# EAGLE design 5v power supply (EAGLE 9.6.2)
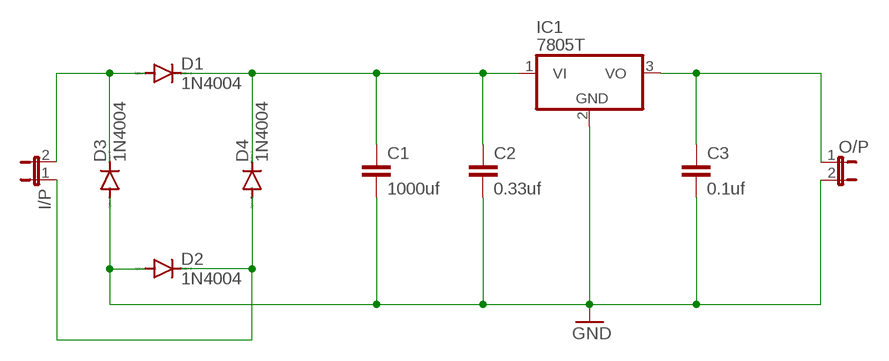
[diagram p0: schematic, sheet 1]

## Parts
C1  1000uf  C2,5-3  [C2.5-3]
C2  0.33uf  C2,5-3  [C2.5-3]
C3  0.1uf  C2,5-3  [C2.5-3]
D1  1N4004  [DO41-10]
D2  1N4004  [DO41-10]
D3  1N4004  [DO41-10]
D4  1N4004  [DO41-10]
I/P  JP1E  [JP1]
IC1  7805T  [TO220H]
O/P  JP1E  [JP1]

## Nets
GND: C1.2 C2.2 C3.2 D2.A D3.A IC1.2(GND) O/P.2
N$1: D1.A D3.C I/P.2
N$2: C1.1 C2.1 D1.C D4.C IC1.1(VI)
N$3: D2.C D4.A I/P.1
N$5: C3.1 IC1.3(VO) O/P.1

## Library data of the parts
C1-C3 = capacitor-wima:C: CAPACITOR naming: grid - package width
D1-D4 = diode:1N4004: DIODE general purpose rectifier, 1 A
I/P O/P = jumper:JP1E: JUMPER
IC1 = linear:78*: Positive VOLTAGE REGULATOR Source: http://cache.national.com/ds/LM/LM78L05.pdf http://www.fairchildsemi.com/ds/LM/LM7805.pdf

## Board
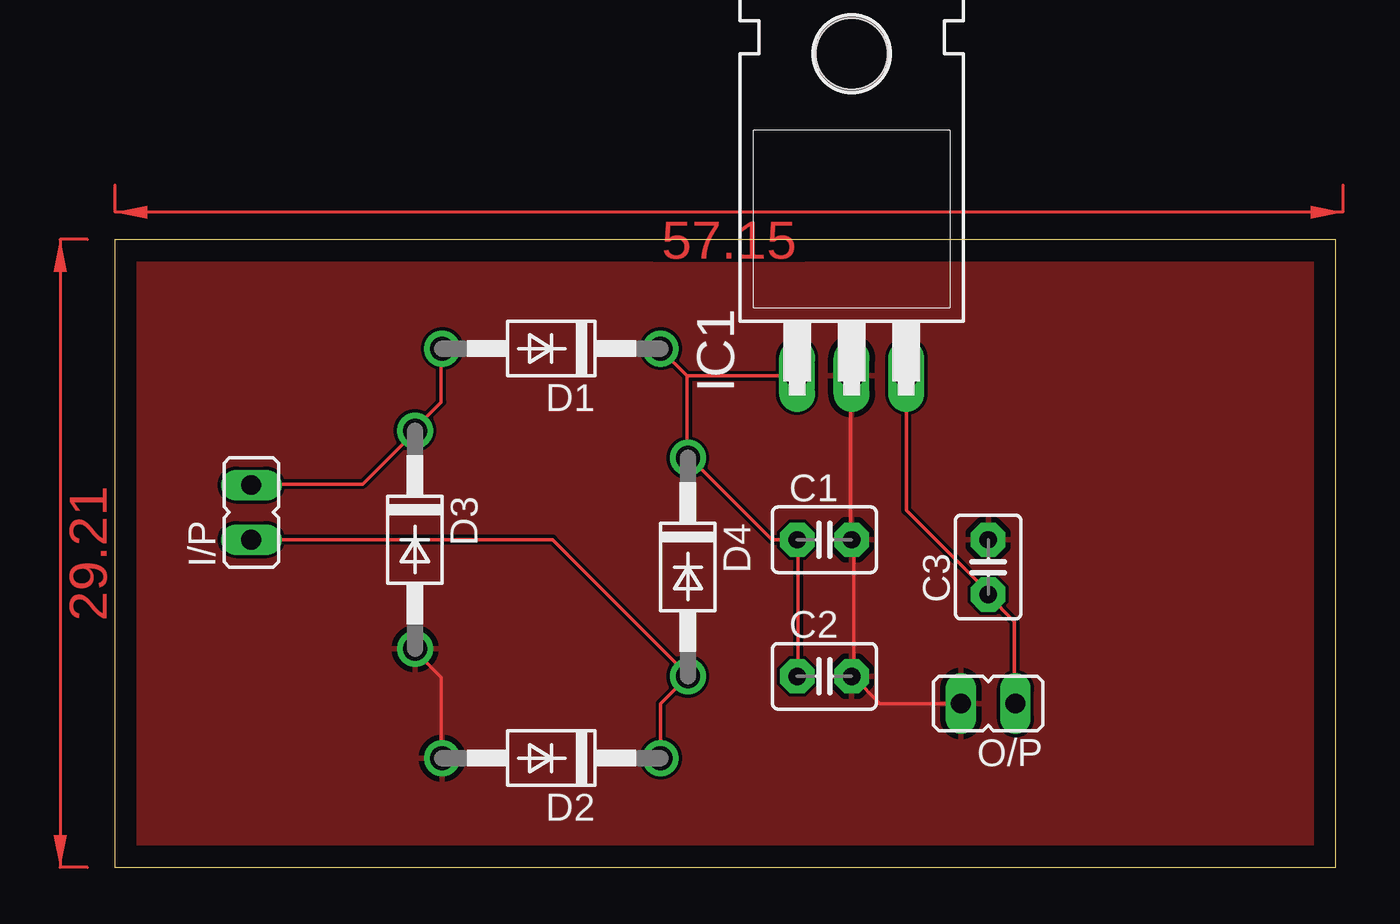
[diagram p1: board, top side]
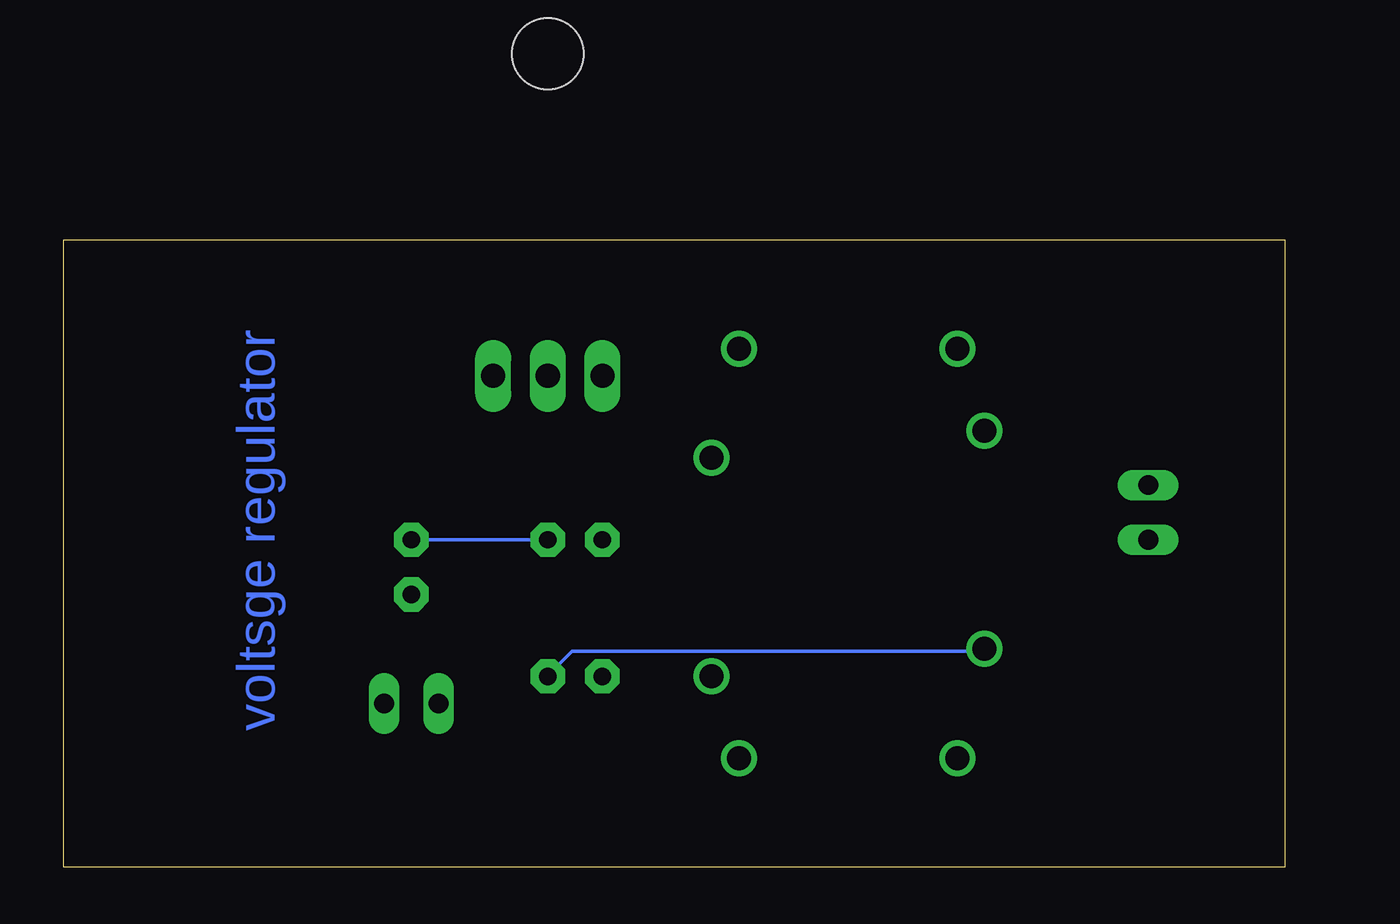
[diagram p2: board, bottom side, seen from below]

Size 56.82 x 29.2 mm. Coordinates in mm from the lower left corner, seen from the top.
Outline: 0,29.2 0,0 56.82,0 56.82,29.2 0,29.2
Copper layers (1*16): Top 0.035mm / dielectric 1.5mm / Bottom 0.035mm
Design rules "default": minimum track width 6mil, minimum drill 0.35mm, track to track 6mil, track to pad 6mil, pad to pad 6mil, via to via 6mil, smd to smd 6mil, copper to edge 40mil, drill to drill 6mil, minimum pad ring 10mil, minimum via ring 8mil, stop-mask expansion 4mil, vias tented up to drill 0mil, thermal gap 10mil

### Footprints (pad centres in the part's own frame; a part is rotated, then mirrored left to right if it is on the bottom)
C2.5-3 = drill 0.813 pad 1.6 octagon: 1 -1.27,0; 2 1.27,0
DO41-10 = drill 1.118: A 5.08,0; C -5.08,0
JP1 = drill 0.914 long: 1 0,-1.27; 2 0,1.27
TO220H = drill 1.118 long: 1 -2.54,-10.16; 2 0,-10.16; 3 2.54,-10.16 | hole 3.302: 0,4.826

### Placement (x,y rotation side)
C1  33.02,15.24 0 top
C2  33.02,8.89 0 top
C3  40.64,13.97 90 top
D1  20.32,24.13 180 top
D2  20.32,5.08 180 top
D3  13.97,15.24 270 top
D4  26.67,13.97 270 top
I/P  6.35,16.51 0 top
IC1  34.29,33.02 0 top
O/P  40.64,7.62 90 top

### Tracks (layer width: path | path; a pad name or v marks a point on that pad's centre or on a via)
GND
  Top 0.152: D2.A 15.19,5.18 15.19,8.84 13.97,10.06 D3.A | O/P.2 35.61,7.62 34.39,8.84 C2.2 34.39,8.99 34.39,15.24 C1.2 34.24,15.24 34.24,22.86 IC1.2
  Bottom 0.152: C1.2 C3.2 | D3.A 13.97,10.06 33.17,10.06 34.24,8.99 C2.2
  pour Top: -5.08,34.29 62.23,34.29 62.23,-3.81 -5.08,-3.81
N$1
  Top 0.152: I/P.2 6.35,17.83 11.53,17.83 13.97,20.27 D3.C 13.97,20.42 15.19,21.64 15.19,24.08 D1.A
N$2
  Top 0.152: C2.1 31.8,8.99 31.8,15.24 C1.1 30.58,15.24 26.77,19.05 D4.C 26.62,19.05 26.62,22.86 | 26.62,22.86 25.4,24.08 D1.C | 26.62,22.86 IC1.1
N$3
  Top 0.152: I/P.1 20.37,15.24 26.62,8.99 D4.A 25.4,7.62 D2.C
N$5
  Top 0.152: O/P.1 41.86,7.62 41.86,11.43 40.64,12.65 C3.1 40.64,12.8 36.83,16.61 IC1.3
(copper drawn outside any net)
  shapes: Top area x3

### Text on the board
Bottom: voltsge regulator